# Altium project CISCO_AP.PrjPcb
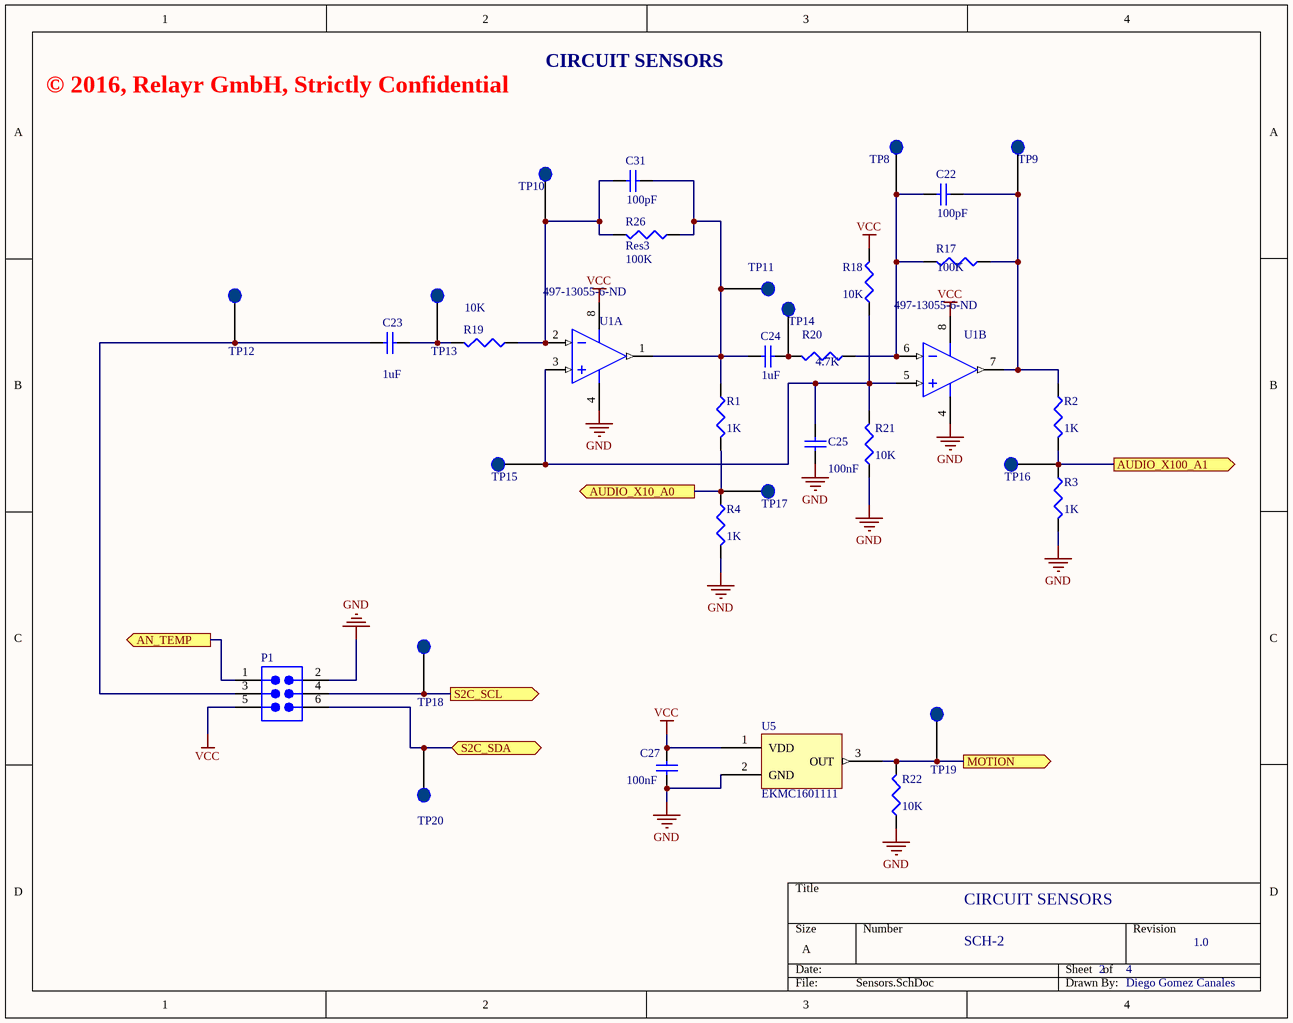
[diagram p0: Sensors.SchDoc]
3 sheets, 86 parts. Net scope: flat (ports and power ports of the same name join across sheets).
Board file: PCB1-CISCO_AP.PcbDoc
Sheets:
  Sensors.SchDoc
  Connector.SchDoc
  Zoul.SchDoc

## Sheet Sensors.SchDoc: CIRCUIT SENSORS
size A; DrawnBy: Diego Gomez Canales; DocumentNumber: SCH-2; Revision: 1.0; SheetNumber: 2; SheetTotal: 4

### Parts
C22  value 100pF  [6-0805_N]  (hidden comment: Cap)
C23  value 1uF  [6-0805_N]  (hidden comment: Cap)
C24  value 1uF  [6-0805_N]  (hidden comment: Cap)
C25  value 100nF  [6-0805_N]  (hidden comment: Cap)
C27  value 100nF  [6-0805_N]  (hidden comment: Cap)
C31  value 100pF  [6-0805_N]  (hidden comment: Cap)
P1  SMTC-TSW-103-08-X-D  [SMTC-TSW-103-08-X-D]  (value not drawn)
R1  value 1K  [6-0805_N]  (hidden comment: Res3)
R2  value 1K  [6-0805_N]  (hidden comment: Res3)
R3  value 1K  [6-0805_N]  (hidden comment: Res3)
R4  value 1K  [6-0805_N]  (hidden comment: Res3)
R17  value 100K  [6-0805_N]  (hidden comment: Res3)
R18  value 10K  [6-0805_N]  (hidden comment: Res3)
R19  value 10K  [6-0805_N]  (hidden comment: Res3)
R20  value 4.7K  [6-0805_N]  (hidden comment: Res3)
R21  value 10K  [6-0805_N]  (hidden comment: Res3)
R22  value 10K  [6-0805_N]  (hidden comment: Res3)
R26  Res3  value 100K  [6-0805_N]
TP8  TEST_POINT  [TP]  (value not drawn)
TP9  TEST_POINT  [TP]  (value not drawn)
TP10  TEST_POINT  [TP]  (value not drawn)
TP11  TEST_POINT  [TP]  (value not drawn)
TP12  TEST_POINT  [TP]  (value not drawn)
TP13  TEST_POINT  [TP]  (value not drawn)
TP14  TEST_POINT  [TP]  (value not drawn)
TP15  TEST_POINT  [TP]  (value not drawn)
TP16  TEST_POINT  [TP]  (value not drawn)
TP17  TEST_POINT  [TP]  (value not drawn)
TP18  TEST_POINT  [TP]  (value not drawn)
TP19  TEST_POINT  [TP]  (value not drawn)
TP20  TEST_POINT  [TP]  (value not drawn)
U1  Supplier Part Number 1: 497-13055-6-ND  [ONSC-MICRO-8-846A-02_H_V]  (hidden comment: ONSC-LM358_NCV2904-8)  (parts A,B of 2)
U5  EKMC1601111  [EKMC1601111]

### Ports
AN_TEMP (out), AUDIO_X10_A0 (out), AUDIO_X100_A1 (out), MOTION (out), S2C_SCL (out), S2C_SDA (bidir)

### Nets
GND: C25.1 C27.1 P1.2 R3.2 R4.2 R21.1 R22.1 U1.4(VEE/GND) U5.2(GND)
VCC: C27.2 P1.5 R18.2 U1.8(VCC) U5.1(VDD)
NetC22_1: C22.1 R2.1 R17.1 TP9.1 U1.7(OUTB)
NetC22_2: C22.2 R17.2 R20.1 TP8.1 U1.6(INB-)
NetC23_1: C23.1 R19.2 TP13.1
NetC23_2: C23.2 P1.3 TP12.1
NetC24_1: C24.1 R20.2 TP14.1
NetC24_2: C24.2 C31.1 R1.1 R26.1 TP11.1 U1.1(OUTA)
NetC25_2: C25.2 R18.1 R21.2 TP15.1 U1.3(INA+) U1.5(INB+)
NetC31_2: C31.2 R19.1 R26.2 TP10.1 U1.2(INA-)
NetP1_1: P1.1 ; port AN_TEMP
NetP1_4: P1.4 TP18.1 ; port S2C_SCL
NetP1_6: P1.6 TP20.1 ; port S2C_SDA
NetR1_2: R1.2 R4.1 TP17.1 ; port AUDIO_X10_A0
NetR2_2: R2.2 R3.1 TP16.1 ; port AUDIO_X100_A1
NetR22_2: R22.2 TP19.1 U5.3(OUT) ; port MOTION

### Notes on the sheet
- © 2016, Relayr GmbH, Strictly Confidential
- CIRCUIT SENSORS

### Library data of the parts
C22-C25 C27 C31 = Cap: Capacitor; Published: 8-Jun-2000; LatestRevisionDate: 17-Jul-2002; LatestRevisionNote: Re-released for DXP Platform.; PackageReference: RAD-0.3; Publisher: Altium Limited; PackageDescription: Radial Cap, Thru-Hole; 2 Leads; 0.3 in Pin Spacing; Supplier 1: Digi-Key
  C22 C31: Supplier Part Number 1: 732-8027-2-ND
  C23: Supplier Part Number 1: 311-1365-2-ND
  C24: Supplier Part Number 1: 311-1365-1-ND
  C25 C27: Supplier Part Number 1: 399-1170-2-ND
R1-R4 R17-R22 R26 = Res3: Resistor; Published: 8-Jun-2000; LatestRevisionDate: 29-May-2009; LatestRevisionNote: IPC-7351 Footprint Added.; PackageReference: J1-0603; Publisher: Altium Limited; PackageDescription: Chip Resistor; Supplier 1: Digi-Key
  R1-R4: Supplier Part Number 1: CRS0805-FX-1001ELFCT-ND
  R17 R26: Supplier Part Number 1: RPC0805JT100KCT-ND
  R18 R19 R21 R22: Supplier Part Number 1: RPC0805JT10K0CT-ND
  R20: Supplier Part Number 1: 311-4.70KCRTR-ND
TP8-TP20 = TEST_POINT: Point of test to manufacturing
U5 = EKMC1601111: EKMC1601111 Panasonic PIR Motion Detection Module; Supplier 1: Digi-Key; Supplier Part Number 1: 255-3074-ND
P1 = SMTC-TSW-103-08-X-D: Supplier 1: Digi-Key; Supplier Part Number 1: SAM1036-03-ND
U1 = ONSC-LM358_NCV2904-8: Supplier 1: Digi-Key

## Sheet Connector.SchDoc: Motherboard Connector
size A; DrawnBy: Diego Gomez Canales; DocumentNumber: SCH-1; Revision: 1.0; SheetNumber: 1; SheetTotal: 4; ProjectName: CISCO AP
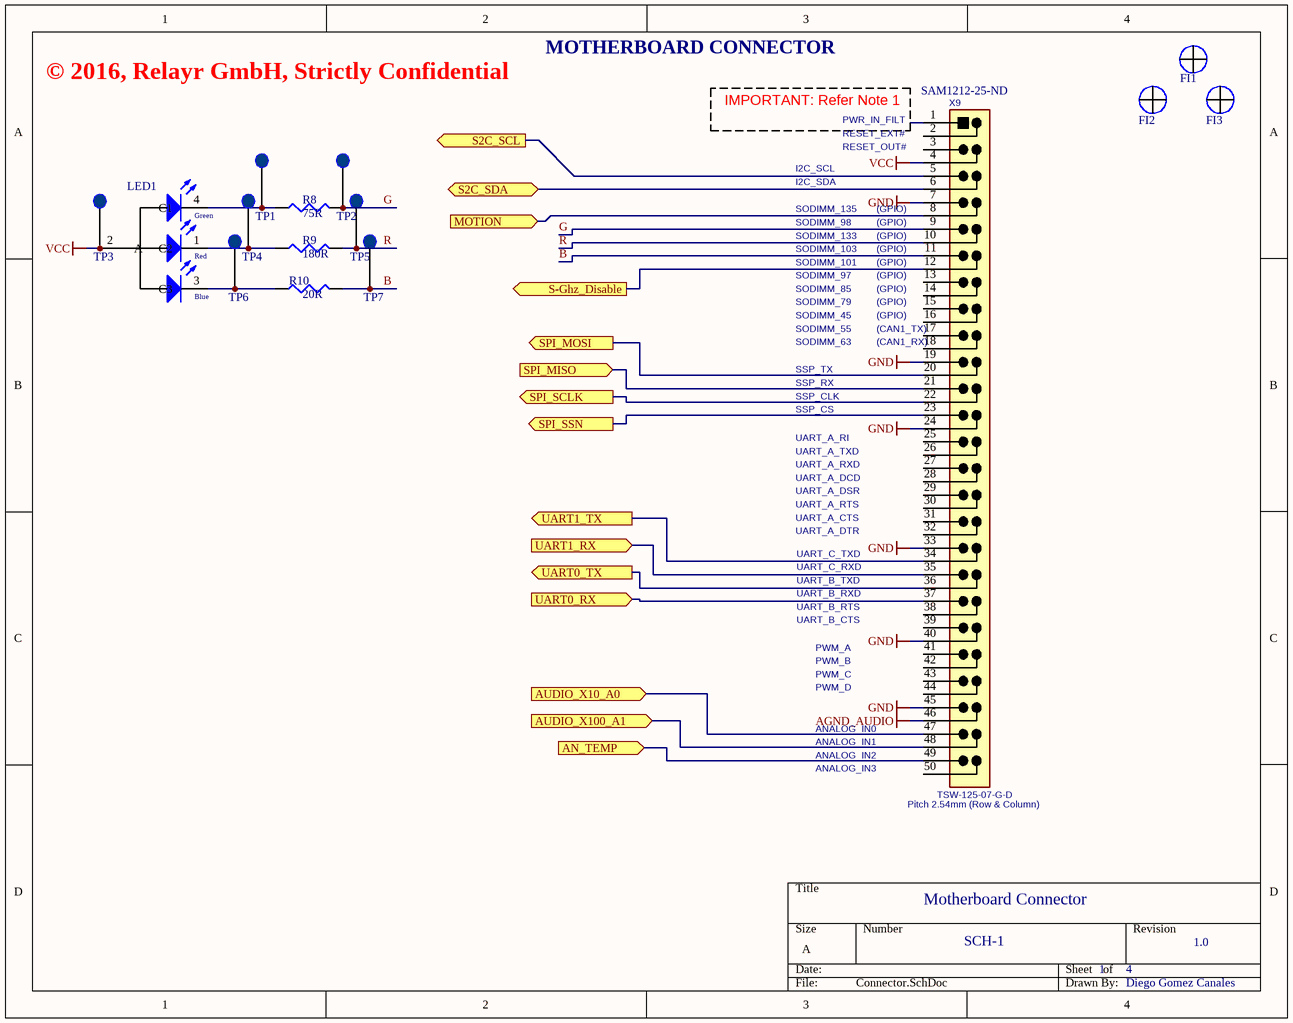
[diagram p1: Connector.SchDoc]

### Parts
FI1  Fidutial  [FIDU]  (value not drawn)
FI2  Fidutial  [FIDU]  (value not drawn)
FI3  Fidutial  [FIDU]  (value not drawn)
LED1  WE-LED_RGB_A1B2R3G4-4  [3528_A]  (value not drawn)
R8  value 75R  [6-0805_N]  (hidden comment: Res3)
R9  value 180R  [6-0805_N]  (hidden comment: Res3)
R10  value 20R  [6-0805_N]  (hidden comment: Res3)
TP1  TEST_POINT  [TP]  (value not drawn)
TP2  TEST_POINT  [TP]  (value not drawn)
TP3  TEST_POINT  [TP]  (value not drawn)
TP4  TEST_POINT  [TP]  (value not drawn)
TP5  TEST_POINT  [TP]  (value not drawn)
TP6  TEST_POINT  [TP]  (value not drawn)
TP7  TEST_POINT  [TP]  (value not drawn)
X9  Supplier Part Number 1: SAM1212-25-ND  [CISCO_AP_SSW-125-01-X-D]  (hidden comment: TSW-125-07-G-D)

### Ports
AN_TEMP (in), AUDIO_X10_A0 (in), AUDIO_X100_A1 (in), MOTION (in), S2C_SCL (out), S2C_SDA (bidir), S-Ghz_Disable (out), SPI_MISO (in), SPI_MOSI (out), SPI_SCLK (out), SPI_SSN (out), UART0_RX (in), UART0_TX (out), UART1_RX (in), UART1_TX (out)

### Nets
AGND_AUDIO: X9.46
GND: X9.7 X9.19 X9.24 X9.33 X9.40 X9.45
VCC: LED1.2(A) TP3.1 X9.4
B: R10.2 TP7.1 X9.11
G: R8.2 TP2.1 X9.9
R: R9.2 TP5.1 X9.10
NetLED1_1: LED1.1(C2) R9.1 TP4.1
NetLED1_3: LED1.3(C3) R10.1 TP6.1
NetLED1_4: LED1.4(C1) R8.1 TP1.1
NetP1_1: X9.49 ; port AN_TEMP
NetP1_4: X9.5 ; port S2C_SCL
NetP1_6: X9.6 ; port S2C_SDA
NetR1_2: X9.47 ; port AUDIO_X10_A0
NetR2_2: X9.48 ; port AUDIO_X100_A1
NetR14_2: X9.12 ; port S-Ghz_Disable
NetR22_2: X9.8 ; port MOTION
NetTP21_1: X9.22 ; port SPI_SCLK
NetTP22_1: X9.20 ; port SPI_MOSI
NetTP25_1: X9.21 ; port SPI_MISO
NetTP28_1: X9.23 ; port SPI_SSN
NetURF1_24: X9.36 ; port UART0_TX
NetURF1_25: X9.37 ; port UART0_RX
NetURF1_26: X9.34 ; port UART1_TX
NetURF1_27: X9.35 ; port UART1_RX

Not connected (* = marked no-connect by the designer): X9 1 2 3 13 14 15 16 17 18 25 26 27 28 29 30 31 32 38 39 41 42 43 44 50

### Notes on the sheet
- © 2016, Relayr GmbH, Strictly Confidential
- MOTHERBOARD CONNECTOR
- IMPORTANT: Refer Note 1
- RESET_EXT#
- RESET_OUT#
- PWR_IN_FILT
- SODIMM_135
- SODIMM_98
- I2C_SCL
- I2C_SDA
- (near X9) (GPIO)
- SODIMM_133
- SODIMM_103
- SODIMM_101
- SODIMM_97
- SODIMM_85
- SODIMM_79
- SODIMM_55
- SODIMM_63
- SODIMM_45
- SSP_TX
- (near X9) (CAN1_TX)
- (near X9) (CAN1_RX)
- SSP_CLK
- SSP_CS
- SSP_RX
- UART_A_RI
- UART_A_TXD
- UART_A_RXD
- UART_A_DCD
- UART_A_DSR
- UART_A_RTS
- UART_A_CTS
- UART_A_DTR
- UART_C_TXD
- UART_C_RXD
- UART_B_RTS
- UART_B_CTS
- UART_B_TXD
- UART_B_RXD
- PWM_C
- PWM_D
- PWM_A
- PWM_B
- ANALOG_IN2
- ANALOG_IN3
- ANALOG_IN0
- ANALOG_IN1
- (near X9) Pitch 2.54mm (Row & Column)
- (in symbol WE-LED_RGB_A1B2R3G4-4) Green; Red; Blue

### Library data of the parts
FI1-FI3 = Fidutial: Fidutial_component
R8-R10 = Res3: Resistor; Published: 8-Jun-2000; LatestRevisionDate: 29-May-2009; LatestRevisionNote: IPC-7351 Footprint Added.; PackageReference: J1-0603; Publisher: Altium Limited; PackageDescription: Chip Resistor; Supplier 1: Digi-Key
  R8: Supplier Part Number 1: RNCP0805FTD75R0CT-ND
  R9: Supplier Part Number 1: RNCP0805FTD180RTR-ND
  R10: Supplier Part Number 1: RNCP0805FTD20R0CT-ND
TP1-TP7 = TEST_POINT: Point of test to manufacturing
X9 = CON-Samtec-TSW-125-07-G-D-Male: Header, 2x25 Pins, 2.54 mm pitch; Manufacturer: Samtec; Pitch: 2.54mm; No. of ways: 2x25; Manufacturer Part Number: TSW-125-07-G-D; Supplier 1: Digi-Key
LED1 = WE-LED_RGB_A1B2R3G4-4: Supplier 1: Digi-Key; Supplier Part Number 1: CLVBA-FKA-CAEDH8BBB7A363CT-ND

## Sheet Zoul.SchDoc: RF COMMUNICATION MODULE
size A; DrawnBy: Diego Gomez Canales; DocumentNumber: SCH-3; Revision: 1.0; SheetNumber: 3; SheetTotal: 4
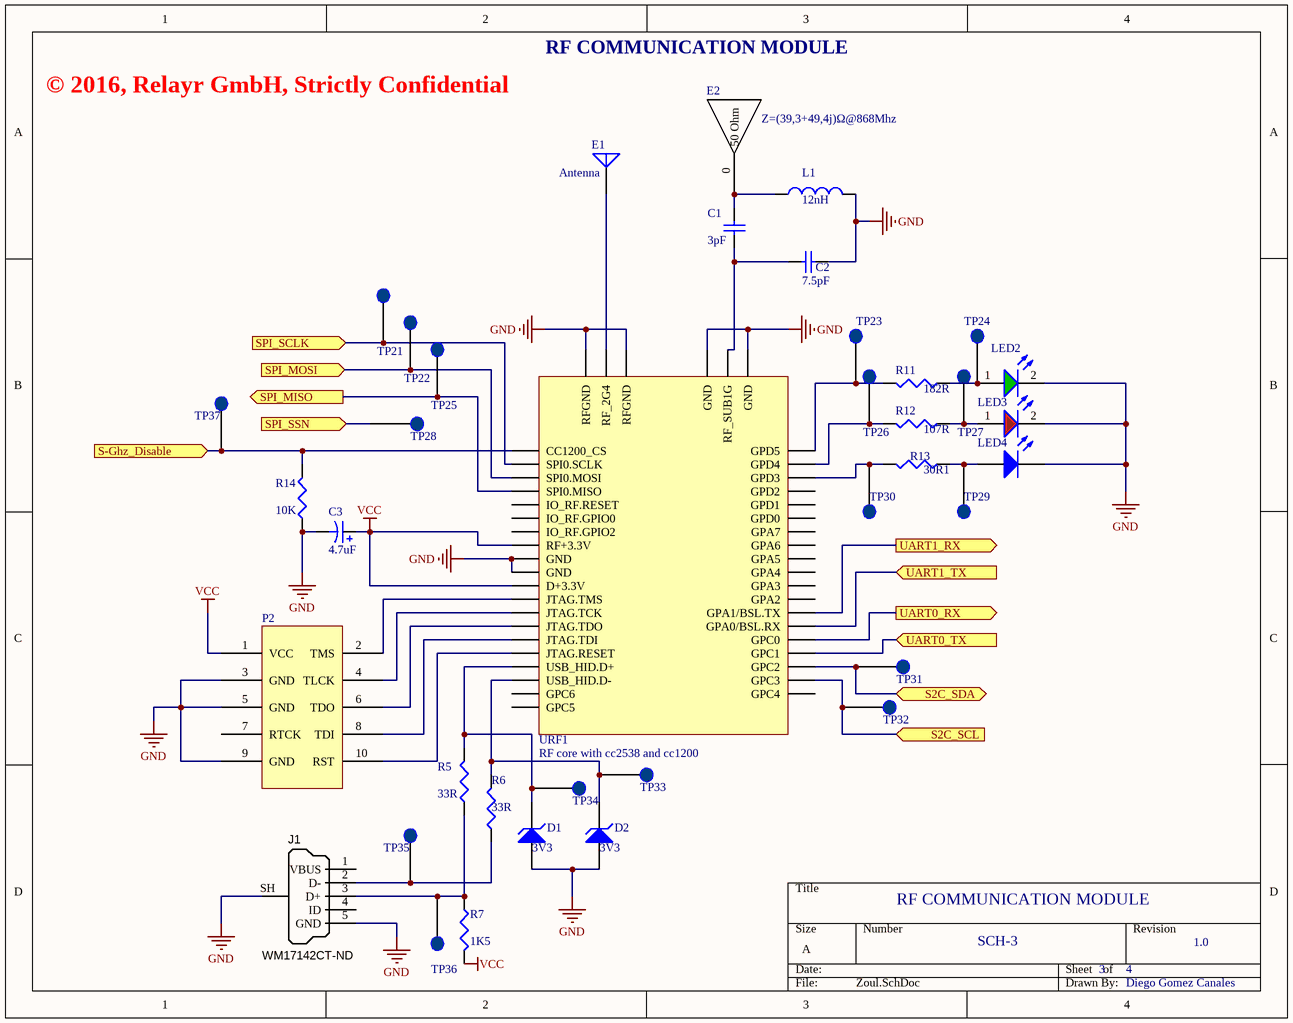
[diagram p2: Zoul.SchDoc]

### Parts
C1  value 3pF  [6-0805_N]  (hidden comment: Cap)
C2  value 7.5pF  [6-0805_N]  (hidden comment: Cap)
C3  value 4.7uF  [C0805]  (hidden comment: Cap Pol3)
D1  3V3  [425]
D2  3V3  [425]
E1  Antenna  [INDC3216]
E2  Component_1  [DNO24]  (value not drawn)
J1  Supplier Part Number 1: WM17142CT-ND  [USB_Micro-B_Molex_SMD]  (hidden comment: USB Micro Type B)
L1  value 12nH  [6-0805_N]  (hidden comment: Inductor)
LED2  150080GS75000  [6-0805_N]  (value not drawn)
LED3  150080RS75000  [6-0805_N]  (value not drawn)
LED4  5988191107F  [6-0805_N]  (value not drawn)
P2  FTSH-105-01-L-DV-K  [JTAG]  (value not drawn)
R5  value 33R  [6-0805_N]  (hidden comment: Res3)
R6  value 33R  [6-0805_N]  (hidden comment: Res3)
R7  value 1K5  [6-0805_N]  (hidden comment: Res3)
R11  value 182R  [6-0805_N]  (hidden comment: Res3)
R12  value 107R  [6-0805_N]  (hidden comment: Res3)
R13  value 30R1  [6-0805_N]  (hidden comment: Res3)
R14  value 10K  [6-0805_N]  (hidden comment: Res3)
TP21  TEST_POINT  [TP]  (value not drawn)
TP22  TEST_POINT  [TP]  (value not drawn)
TP23  TEST_POINT  [TP]  (value not drawn)
TP24  TEST_POINT  [TP]  (value not drawn)
TP25  TEST_POINT  [TP]  (value not drawn)
TP26  TEST_POINT  [TP]  (value not drawn)
TP27  TEST_POINT  [TP]  (value not drawn)
TP28  TEST_POINT  [TP]  (value not drawn)
TP29  TEST_POINT  [TP]  (value not drawn)
TP30  TEST_POINT  [TP]  (value not drawn)
TP31  TEST_POINT  [TP]  (value not drawn)
TP32  TEST_POINT  [TP]  (value not drawn)
TP33  TEST_POINT  [TP]  (value not drawn)
TP34  TEST_POINT  [TP]  (value not drawn)
TP35  TEST_POINT  [TP]  (value not drawn)
TP36  TEST_POINT  [TP]  (value not drawn)
TP37  TEST_POINT  [TP]  (value not drawn)
URF1  RF core with cc2538 and cc1200  [ZOUL]

### Ports
S2C_SCL (in), S2C_SDA (bidir), S-Ghz_Disable (in), SPI_MISO (out), SPI_MOSI (in), SPI_SCLK (in), SPI_SSN (in), UART0_RX (out), UART0_TX (in), UART1_RX (out), UART1_TX (in)

### Nets
GND: C2.1 C3.2 D1.1(A) D2.1(A) J1.5(GND) J1.SH(Shell) L1.2 LED2.2(C) LED3.2(C) LED4.2(K) P2.3(GND) P2.5(GND) P2.9(GND) R14.1 URF1.9(GND) URF1.10(GND) URF1.40(GND) URF1.42(GND) URF1.43(RFGND) URF1.45(RFGND)
VCC: C3.1 P2.1(VCC) R7.2 URF1.8(RF+3.3V) URF1.11(D+3.3V)
NetC1_1: C1.1 C2.2 URF1.41(RF_SUB1G)
NetC1_2: C1.2 E2.0(50_Ohm) L1.1
NetD1_2: D1.2(K) R5.2 TP34.1 URF1.17(USB_HID.D+)
NetD2_2: D2.2(K) R6.2 TP33.1 URF1.18(USB_HID.D-)
NetE1_1: E1.1(A) URF1.44(RF_2G4)
NetJ1_2: J1.2(D-) R6.1 TP35.1
NetJ1_3: J1.3(D+) R5.1 R7.1 TP36.1
NetLED2_1: LED2.1(A) R11.1 TP24.1
NetLED3_1: LED3.1(A) R12.1 TP27.1
NetLED4_1: LED4.1(A) R13.1 TP29.1
NetP1_4: TP32.1 URF1.22(GPC3) ; port S2C_SCL
NetP1_6: TP31.1 URF1.23(GPC2) ; port S2C_SDA
NetP2_2: P2.2(TMS) URF1.12(JTAG.TMS)
NetP2_4: P2.4(TLCK) URF1.13(JTAG.TCK)
NetP2_6: P2.6(TDO) URF1.14(JTAG.TDO)
NetP2_8: P2.8(TDI) URF1.15(JTAG.TDI)
NetP2_10: P2.10(RST) URF1.16(JTAG.RESET)
NetR11_2: R11.2 TP23.1 URF1.39(GPD5)
NetR12_2: R12.2 TP26.1 URF1.38(GPD4)
NetR13_2: R13.2 TP30.1 URF1.37(GPD3)
NetR14_2: R14.2 TP37.1 URF1.1(CC1200_CS) ; port S-Ghz_Disable
NetTP21_1: TP21.1 URF1.2(SPI0.SCLK) ; port SPI_SCLK
NetTP22_1: TP22.1 URF1.3(SPI0.MOSI) ; port SPI_MOSI
NetTP25_1: TP25.1 URF1.4(SPI0.MISO) ; port SPI_MISO
NetTP28_1: TP28.1 ; port SPI_SSN
NetURF1_24: URF1.24(GPC1) ; port UART0_TX
NetURF1_25: URF1.25(GPC0) ; port UART0_RX
NetURF1_26: URF1.26(GPA0/BSL.RX) ; port UART1_TX
NetURF1_27: URF1.27(GPA1/BSL.TX) ; port UART1_RX

Not connected (* = marked no-connect by the designer): J1 1(VBUS) 4(ID); P2 7(RTCK); URF1 5(IO_RF.RESET) 6(IO_RF.GPIO0) 7(IO_RF.GPIO2) 19(GPC6) 20(GPC5) 21(GPC4) 28(GPA2) 29(GPA3) 30(GPA4) 31(GPA5) 32(GPA6) 33(GPA7) 34(GPD0) 35(GPD1) 36(GPD2)

### Notes on the sheet
- © 2016, Relayr GmbH, Strictly Confidential
- RF COMMUNICATION MODULE
- (near E2) Z=(39,3+49,4j)Ω@868Mhz

### Library data of the parts
C1 C2 = Cap: Capacitor; Published: 8-Jun-2000; LatestRevisionDate: 17-Jul-2002; LatestRevisionNote: Re-released for DXP Platform.; PackageReference: RAD-0.3; Publisher: Altium Limited; PackageDescription: Radial Cap, Thru-Hole; 2 Leads; 0.3 in Pin Spacing; Supplier 1: Digi-Key
  C1: Supplier Part Number 1: 1276-2550-2-ND
  C2: Supplier Part Number 1: 712-1374-2-ND
C3 = Cap Pol3: Polarized Capacitor (Surface Mount); Published: 8-Jun-2000; LatestRevisionDate: 29-May-2009; LatestRevisionNote: IPC-7351 Footprint Added.; PackageReference: C0805; Publisher: Altium Limited; PackageDescription: Chip Capacitor; Supplier 1: Digi-Key; Supplier Part Number 1: 490-3335-2-ND
D1 D2 = D Zener: Zener Diode; Published: 8-Jun-2000; LatestRevisionDate: 17-Jul-2002; LatestRevisionNote: Re-released for DXP Platform.; PackageReference: DIODE-0.7; Publisher: Altium Limited; PackageDescription: Diode, Thru-Hole; 2 Leads; 0.7 in Pin Spacing; Supplier 1: Digi-Key; Supplier Part Number 1: DZ2J03300LTR-ND
E1 = Antenna: Generic Antenna; Published: 24-Mar-1999; LatestRevisionDate: 17-Jul-2002; LatestRevisionNote: Re-released for DXP Platform.; PackageReference: PIN1; Publisher: Altium Limited; Supplier 1: Digi-Key; Supplier Part Number 1: 712-1005-2-ND
E2 = Component_1: Antenna SubGhz PCB
J1 = USB_Micro_TypeB_1: Connector SMD USB Micro Type B middle mount; Manufacturer 1: Molex Inc; Manufacturer Part Number 1: 47491-0001; SCDType: undef; Package / Case: SMD; Supplier 1: Digi-Key
L1 = Inductor: Code_IEC: 1005; Published: 8-Jun-2000; LatestRevisionDate: 29-May-2009; LatestRevisionNote: IPC-7351 Footprint Added.; PackageReference: 0402-A; Publisher: Altium Limited; PackageDescription: Chip Inductor; Code_JEITA: 0402; Supplier 1: Digi-Key; Supplier Part Number 1: 535-11555-2-ND
LED2 = WL-SMCW 0805  150080GS75000: SMD mono-color Chip LED, WL-SMCW, Green; Manufacturer: W黵th Elektronik eiSos GmbH; PartNo: 150080GS75000; ComponentLink1Description: Manufacturer; ComponentLink1URL: http://www.we-online.de; Created by: Christin Otto; Created Date: June 2013; ComponentLink2Description: Datasheet; ComponentLink2URL: http://katalog.we-online.com/led/datasheet/150080GS75000.pdf; Color: Green; Supplier 1: Digi-Key; Supplier Part Number 1: 732-4983-1-ND
LED3 = WL-SMCW 0805  150080RS75000: SMD mono-color Chip LED, WL-SMCW, Red; Manufacturer: W黵th Elektronik eiSos GmbH; PartNo: 150080RS75000; ComponentLink1Description: Manufacturer; ComponentLink1URL: http://www.we-online.de; Created by: Christin Otto; Created Date: June 2013; ComponentLink2Description: Datasheet; ComponentLink2URL: http://katalog.we-online.com/led/datasheet/150080RS75000.pdf; Color: Red; Supplier 1: Digi-Key; Supplier Part Number 1: 732-4984-1-ND
LED4 = LED0: Blue 473nm LED Indication - Discrete 3.2V 0805 (2012 Metric); Published: 8-Jun-2000; LatestRevisionDate: 08-Jul-2005; LatestRevisionNote: Mech Layer 1 removed.; PackageReference: LED-0; Publisher: Altium Limited; PackageDescription: LED; 2 Leads; Supplier 1: Digi-Key; Supplier Part Number 1: 350-2046-1-ND
P2 = Component_1: Supplier 1: Digi-Key; Supplier Part Number 1: SAM8799-ND
R5-R7 R11-R14 = Res3: Resistor; Published: 8-Jun-2000; LatestRevisionDate: 29-May-2009; LatestRevisionNote: IPC-7351 Footprint Added.; PackageReference: J1-0603; Publisher: Altium Limited; PackageDescription: Chip Resistor; Supplier 1: Digi-Key
  R5 R6: Supplier Part Number 1: RPC0805JT33R0CT-ND
  R7: Supplier Part Number 1: RNCP0805FTD1K50TR-ND
  R11: Supplier Part Number 1: A110472CT-ND
  R12: Supplier Part Number 1: A110450CT-ND
  R13: Supplier Part Number 1: A110397CT-ND
  R14: Supplier Part Number 1: RPC0805JT10K0CT-ND
TP21-TP37 = TEST_POINT: Point of test to manufacturing
URF1 = ZOUL: Supplied By: Zolertia

## Nets that join several sheets
GND: Sensors (9 pins), Connector (6 pins), Zoul (20 pins)
VCC: Sensors (5 pins), Connector (LED1.2 TP3.1 X9.4), Zoul (5 pins)
NetP1_1: Sensors (P1.1), Connector (X9.49)
NetP1_4: Sensors (P1.4 TP18.1), Connector (X9.5), Zoul (TP32.1 URF1.22)
NetP1_6: Sensors (P1.6 TP20.1), Connector (X9.6), Zoul (TP31.1 URF1.23)
NetR1_2: Sensors (R1.2 R4.1 TP17.1), Connector (X9.47)
NetR2_2: Sensors (R2.2 R3.1 TP16.1), Connector (X9.48)
NetR14_2: Connector (X9.12), Zoul (R14.2 TP37.1 URF1.1)
NetR22_2: Sensors (R22.2 TP19.1 U5.3), Connector (X9.8)
NetTP21_1: Connector (X9.22), Zoul (TP21.1 URF1.2)
NetTP22_1: Connector (X9.20), Zoul (TP22.1 URF1.3)
NetTP25_1: Connector (X9.21), Zoul (TP25.1 URF1.4)
NetTP28_1: Connector (X9.23), Zoul (TP28.1)
NetURF1_24: Connector (X9.36), Zoul (URF1.24)
NetURF1_25: Connector (X9.37), Zoul (URF1.25)
NetURF1_26: Connector (X9.34), Zoul (URF1.26)
NetURF1_27: Connector (X9.35), Zoul (URF1.27)